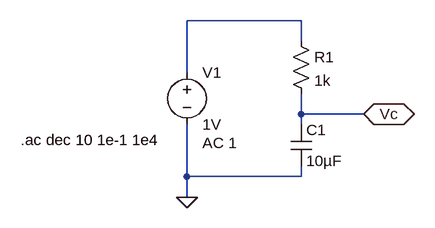
[diagram p0: schematic RC-Lowpass_Bode_Plot_V001.asc]
RC-Lowpass_Bode_Plot_V001.asc, the LTspice schematic file:
Version 4
SHEET 1 880 680
WIRE 224 32 48 32
WIRE 224 64 224 32
WIRE 48 112 48 32
WIRE 224 176 224 144
WIRE 320 176 224 176
WIRE 224 192 224 176
WIRE 48 272 48 192
WIRE 224 272 224 256
WIRE 224 272 48 272
WIRE 48 304 48 272
FLAG 48 304 0
FLAG 320 176 Vc
IOPIN 320 176 BiDir
SYMBOL cap 208 192 R0
SYMATTR InstName C1
SYMATTR Value 10µF
SYMBOL res 208 48 R0
SYMATTR InstName R1
SYMATTR Value 1k
SYMBOL voltage 48 96 R0
WINDOW 123 24 124 Left 2
WINDOW 39 0 0 Left 0
SYMATTR InstName V1
SYMATTR Value 1V
SYMATTR Value2 AC 1
TEXT -208 216 Left 2 !.ac dec 10 1e-1 1e4

The netlist it stands for:
* RC-Lowpass_Bode_Plot_V001.asc
C1 Vc 0 10µF
R1 N001 Vc 1k
V1 N001 0 1V AC 1
.ac dec 10 1e-1 1e4
.backanno
.end

* Results of the author's LTspice run, read from the files saved beside the schematic
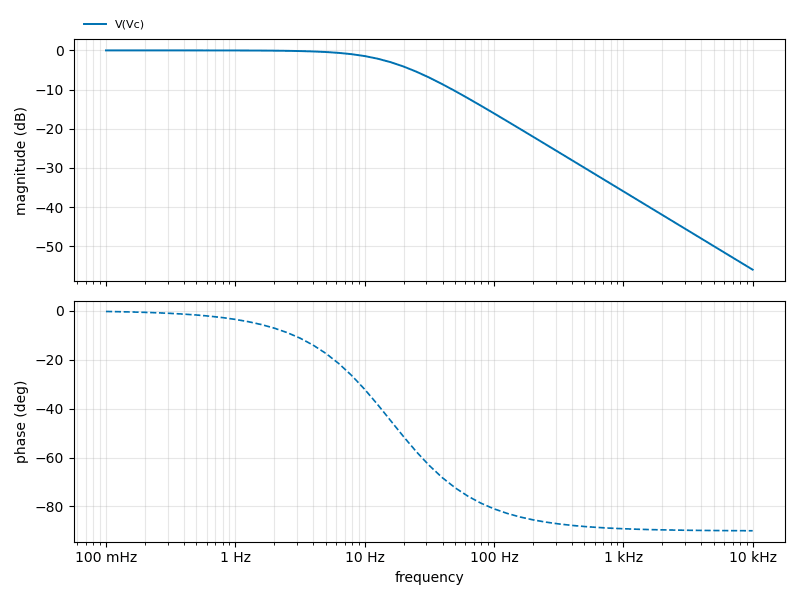
[diagram p1: AC Analysis of RC-Lowpass_Bode_Plot_V001.asc, plotted from the saved traces]
* AC Analysis, 1 run:
*   V(Vc): -0.00 dB at 100 mHz, -55.96 dB at 10 kHz, peak -0.00 dB at 100 mHz, 3 dB below the peak at 15.91 Hz